# EAGLE design WiFiSensor (EAGLE 7.3.0)
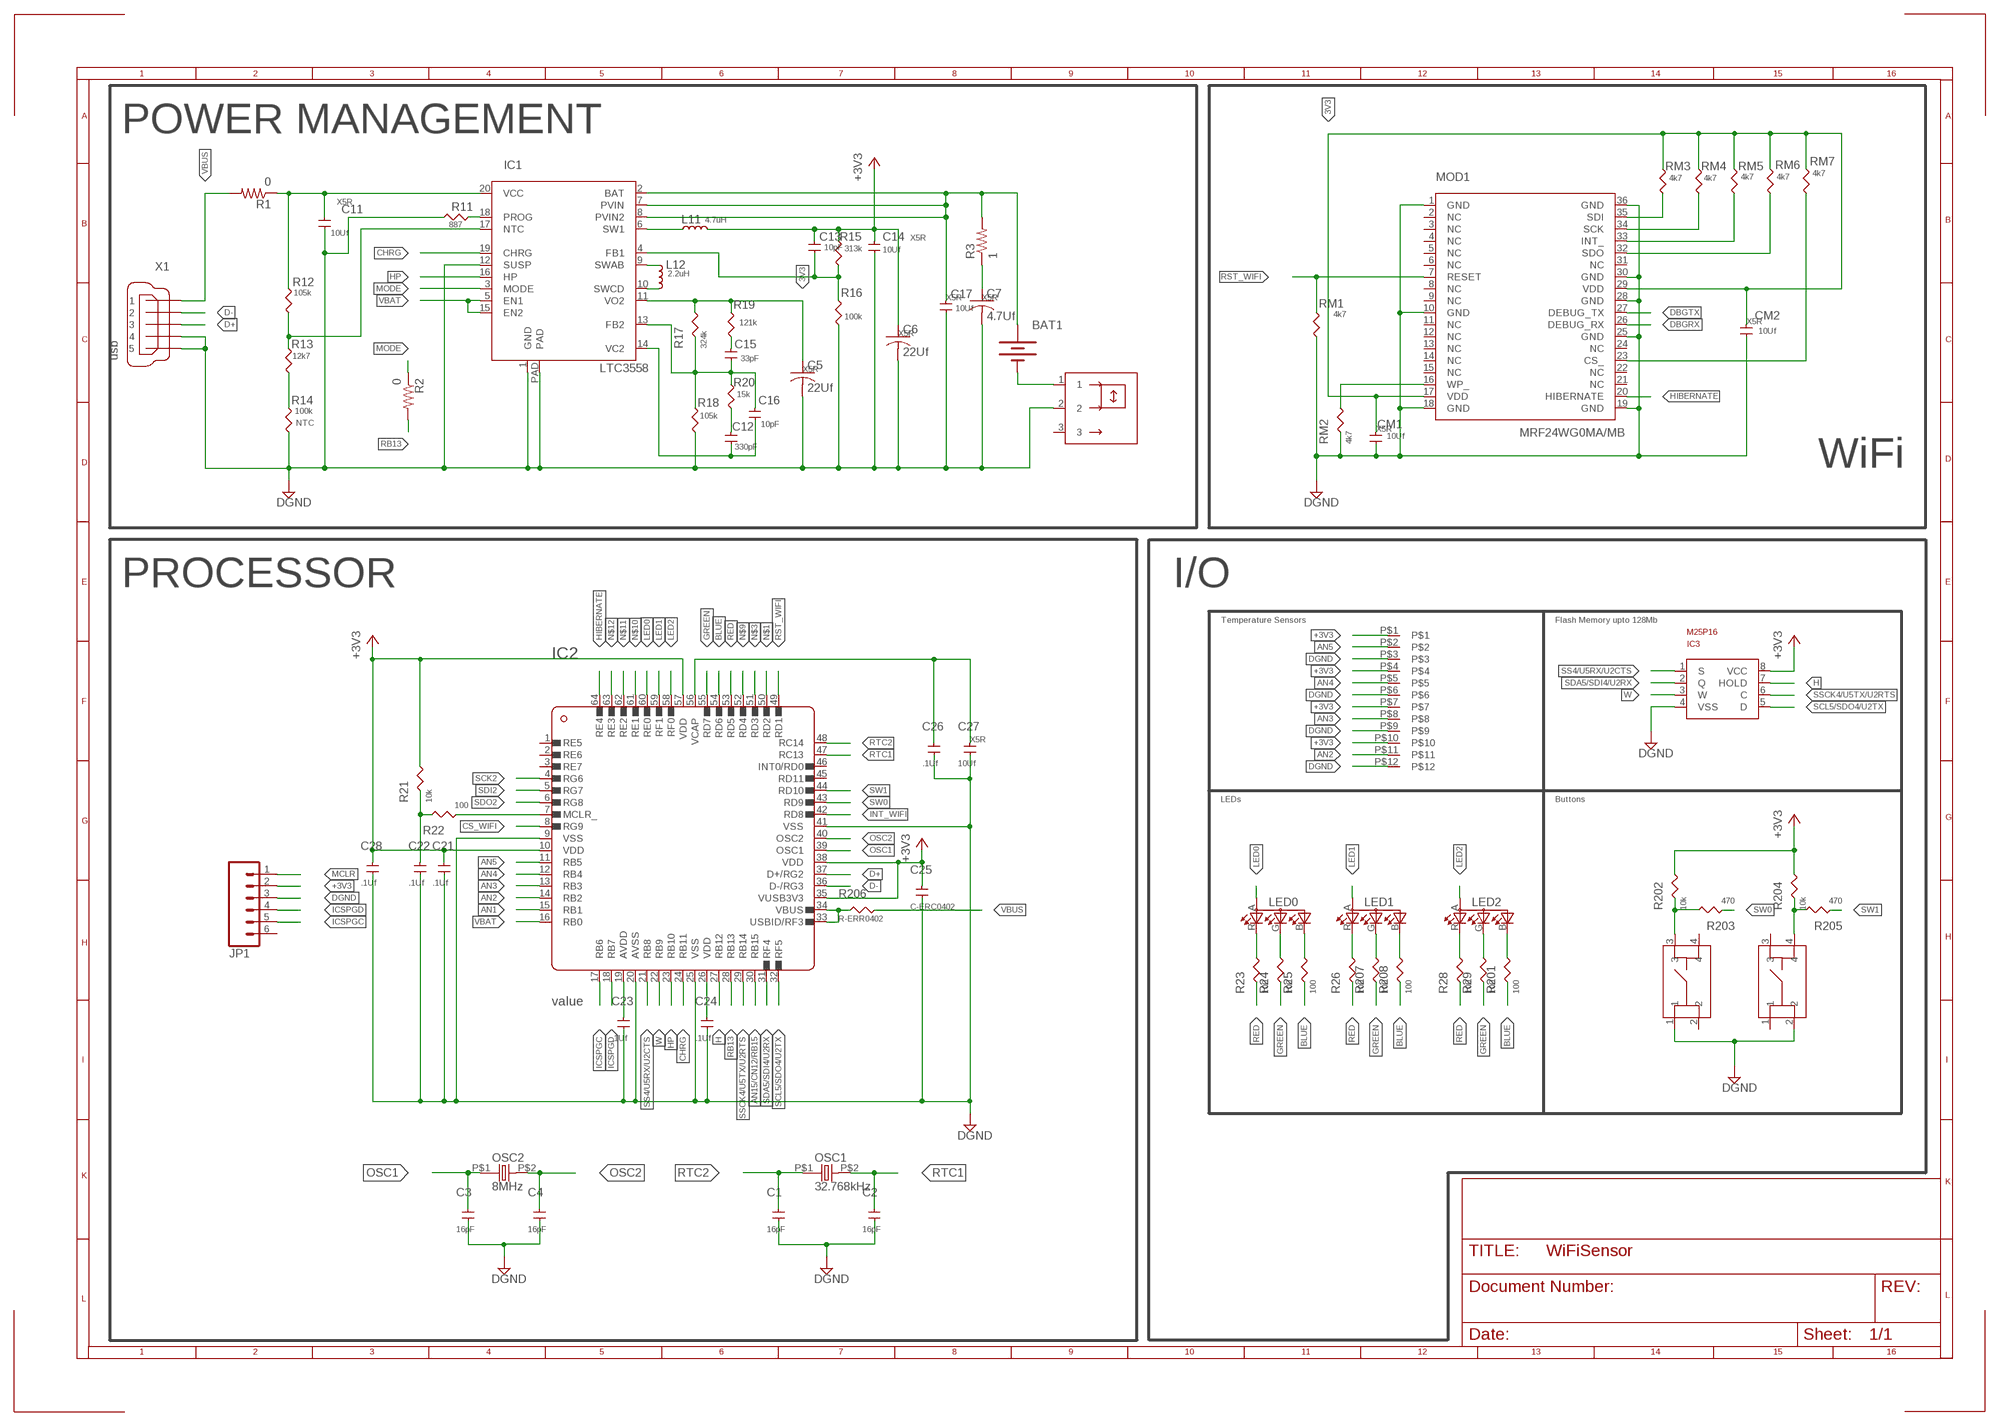
[diagram p0: schematic, sheet 1]

## Parts
BAT1  BATTERY245PTH  [BATTCON_245MM_PTH]
C1  16pF  C-ERC0402  [C0402]
C2  16pF  C-ERC0402  [C0402]
C3  16pF  C-ERC0402  [C0402]
C4  16pF  C-ERC0402  [C0402]
C5  22Uf  C-USC0805  [C0805]
C6  22Uf  C-USC0805  [C0805]
C7  4.7Uf  C-USC0402  [C0402]
C11  10Uf  C-ER  [C0805]
C12  330pF  C-ERC0402  [C0402]
C13  10pF  C-ERC0402  [C0402]
C14  10Uf  C-ER  [C0805]
C15  33pF  C-ERC0402  [C0402]
C16  10pF  C-ERC0402  [C0402]
C17  10Uf  C-ER  [C0805]
C21  .1Uf  C-ERC0402  [C0402]
C22  .1Uf  C-ERC0402  [C0402]
C23  .1Uf  C-ERC0402  [C0402]
C24  .1Uf  C-ERC0402  [C0402]
C25  C-ERC0402  [C0402]
C26  .1Uf  C-ERC0402  [C0402]
C27  10Uf  C-ER  [C0805]
C28  .1Uf  C-ERC0402  [C0402]
CM1  10Uf  C-ER  [C0805]
CM2  10Uf  C-ER  [C0805]
IC1  LTC3558  [QFN20]
IC2  PICMX32695F512H  [TQFP64]
IC3  M25P16  [VDFPN8]
JP1  M06LOCK  [1X06_LOCK]
L11  4.7uH  L-ER  [L3010]
L12  2.2uH  L-ER  [L3010]
LED0  1X1RGB  [1X1]
LED1  1X1RGB  [1X1]
LED2  1X1RGB  [1X1]
MOD1  MRF24WG0MA/MB  [MRF24]
OSC1  32.768kHz  ECX32  [ECX39]
OSC2  8MHz  CX532  [CX532]
R1  0  R-US_R1206  [R1206]
R2  0  R-US_R1206  [R1206]
R3  1  R-US_R0402  [R0402]
R11  887  R-ERR0402  [R0402]
R12  105k  R-ERR0402  [R0402]
R13  12k7  R-ERR0402  [R0402]
R14  100k  R-ERR0402  [R0402]
R15  313k  R-ERR0402  [R0402]
R16  100k  R-ERR0402  [R0402]
R17  324k  R-ERR0402  [R0402]
R18  105k  R-ERR0402  [R0402]
R19  121k  R-ERR0402  [R0402]
R20  15k  R-ERR0402  [R0402]
R21  10k  R-ERR0402  [R0402]
R22  100  R-ERR0402  [R0402]
R23  100  R-ERR0402  [R0402]
R24  100  R-ERR0402  [R0402]
R25  100  R-ERR0402  [R0402]
R26  100  R-ERR0402  [R0402]
R28  100  R-ERR0402  [R0402]
R29  100  R-ERR0402  [R0402]
R201  100  R-ERR0402  [R0402]
R202  10k  R-ERR0402  [R0402]
R203  470  R-ERR0402  [R0402]
R204  10k  R-ERR0402  [R0402]
R205  470  R-ERR0402  [R0402]
R206  R-ERR0402  [R0402]
R207  100  R-ERR0402  [R0402]
R208  100  R-ERR0402  [R0402]
RM1  4k7  R-ERR0402  [R0402]
RM2  4k7  R-ERR0402  [R0402]
RM3  4k7  R-ERR0402  [R0402]
RM4  4k7  R-ERR0402  [R0402]
RM5  4k7  R-ERR0402  [R0402]
RM6  4k7  R-ERR0402  [R0402]
RM7  4k7  R-ERR0402  [R0402]
SENSORS  12_127  [12-127]
U$1  C&K_JS  [SAQN]
U$2  ADTS  [4X5]
U$3  ADTS  [4X5]
X1  usb  MINI-USB-UX60A-MB-5ST  [UX60A-MB-5ST]

## Nets
3V3: C5.1 CM1.2 CM2.2 IC1.11(VO2) MOD1.17(VDD) MOD1.29(VDD) R17.2 R19.2 RM3.2 RM4.2 RM5.2 RM6.2 RM7.2
+3V3: C6.1 C13.2 C14.2 C21.2 C23.2 C24.2 C25.2 C28.2 IC2.10(VDD) IC2.19(AVDD) IC2.26(VDD) IC2.35(VUSB3V3) IC2.38(VDD) IC2.57(VDD) IC3.8(VCC) JP1.2 L11.P$2 R15.2 R21.2 R202.2 R204.2 SENSORS.P$1 SENSORS.P$4 SENSORS.P$7 SENSORS.P$10
AN1: IC2.15(RB1)
AN2: IC2.14(RB2) SENSORS.P$11
AN3: IC2.13(RB3) SENSORS.P$8
AN4: IC2.12(RB4) SENSORS.P$5
AN5: IC2.11(RB5) SENSORS.P$2
AN15/CN12/RB15: IC2.30(RB15)
BLUE: IC2.54(RD6) R25.1 R201.1 R208.1
CHRG: IC1.19(CHRG) IC2.24(RB11)
CS_WIFI: IC2.8(RG9) MOD1.23(CS_) RM7.1
D+: IC2.37(D+/RG2) X1.3
D-: IC2.36(D-/RG3) X1.2
DBGRX: MOD1.26(DEBUG_RX)
DBGTX: MOD1.27(DEBUG_TX)
DGND: C1.1 C2.1 C3.1 C4.1 C5.2 C6.2 C7.2 C11.1 C14.1 C17.1 C21.1 C22.1 C23.1 C24.1 C25.1 C26.1 C27.1 C28.1 CM1.1 CM2.1 IC1.1(GND) IC1.12(SUSP) IC1.PAD IC2.9(VSS) IC2.20(AVSS) IC2.25(VSS) IC2.41(VSS) IC3.4(VSS) JP1.3 MOD1.1(GND) MOD1.10(GND) MOD1.18(GND) MOD1.19(GND) MOD1.25(GND) MOD1.28(GND) MOD1.30(GND) MOD1.36(GND) R11.2 R14.1 R16.1 R18.1 RM1.1 RM2.1 SENSORS.P$3 SENSORS.P$6 SENSORS.P$9 SENSORS.P$12 U$1.2 U$2.2 U$3.1 X1.4 X1.5
GREEN: IC2.55(RD7) R24.1 R29.1 R207.1
H: IC2.27(RB12) IC3.7(HOLD)
HIBERNATE: IC2.64(RE4) MOD1.20(HIBERNATE)
HP: IC1.16(HP) IC2.23(RB10)
ICSPGC: IC2.17(RB6) JP1.5
ICSPGD: IC2.18(RB7) JP1.4
INT_WIFI: IC2.42(RD8) MOD1.33(INT_) RM5.1
LED0: IC2.60(RE0) LED0.A(A2)
LED1: IC2.59(RF1) LED1.A(A2)
LED2: IC2.58(RF0) LED2.A(A2)
MCLR: C22.2 JP1.1 R21.1 R22.2
MODE: IC1.3(MODE) R2.1
N$1: IC2.50(RD2)
N$2: IC1.18(PROG) R11.1
N$3: IC2.51(RD3)
N$4: IC1.17(NTC) R12.1 R13.2
N$5: R13.1 R14.2
N$6: C15.1 C16.2 IC1.13(FB2) R17.1 R18.2 R20.2
N$7: BAT1.2(-) U$1.1
N$8: C7.1 R3.1
N$9: IC2.52(RD4)
N$10: IC2.61(RE1)
N$11: IC2.62(RE2)
N$12: IC2.63(RE3)
N$13: IC1.9(SWAB) L12.P$1
N$14: IC1.10(SWCD) L12.P$2
N$15: IC1.6(SW1) L11.P$1
N$18: C15.2 R19.1
N$20: C12.2 R20.1
N$21: C12.1 C16.1 IC1.14(VC2)
N$24: IC2.33(USBID/RF3) IC2.34(VBUS) R206.1
N$25: IC2.7(MCLR_) R22.1
N$26: R202.1 R203.2 U$3.3
N$31: C26.2 C27.2 IC2.56(VCAP)
N$33: R204.1 R205.2 U$2.4
N$34: LED0.R(CRED) R23.2
N$40: LED0.G(CBLUE) R24.2
N$41: MOD1.16(WP_) RM2.2
N$42: LED0.B(CGREEN) R25.2
N$43: LED1.R(CRED) R26.2
N$44: LED1.G(CBLUE) R207.2
N$45: LED1.B(CGREEN) R208.2
N$46: LED2.R(CRED) R28.2
N$47: LED2.G(CBLUE) R29.2
N$48: LED2.B(CGREEN) R201.2
N$49: C13.1 IC1.4(FB1) R15.1 R16.2
N$100: C11.2 IC1.20(VCC) R1.1 R12.2
OSC1: C3.2 IC2.39(OSC1) OSC2.P$1
OSC2: C4.2 IC2.40(OSC2) OSC2.P$2
RB13: IC2.28(RB13) R2.2
RED: IC2.53(RD5) R23.1 R26.1 R28.1
RST_WIFI: IC2.49(RD1) MOD1.7(RESET) RM1.2
RTC1: C2.2 IC2.47(RC13) OSC1.P$2
RTC2: C1.2 IC2.48(RC14) OSC1.P$1
SCK2: IC2.4(RG6) MOD1.34(SCK) RM4.1
SCL5/SDO4/U2TX: IC2.32(RF5) IC3.5(D)
SDA5/SDI4/U2RX: IC2.31(RF4) IC3.2(Q)
SDI2: IC2.5(RG7) MOD1.32(SDO) RM6.1
SDO2: IC2.6(RG8) MOD1.35(SDI) RM3.1
SS4/U5RX/U2CTS: IC2.21(RB8) IC3.1(S)
SSCK4/U5TX/U2RTS: IC2.29(RB14) IC3.6(C)
SW0: IC2.43(RD9) R203.1
SW1: IC2.44(RD10) R205.1
VBAT: BAT1.3(+) C17.2 IC1.2(BAT) IC1.5(EN1) IC1.7(PVIN) IC1.8(PVIN2) IC1.15(EN2) IC2.16(RB0) R3.2
VBUS: R1.2 R206.2 X1.1
W: IC2.22(RB9) IC3.3(W)
Unconnected: IC2.1(RE5) IC2.2(RE6) IC2.3(RE7) IC2.45(RD11) IC2.46(INT0/RD0) JP1.6 MOD1.2(NC) MOD1.3(NC) MOD1.4(NC) MOD1.5(NC) MOD1.6(NC) MOD1.8(NC) MOD1.9(NC) MOD1.11(NC) MOD1.12(NC) MOD1.13(NC) MOD1.14(NC) MOD1.15(NC) MOD1.21(NC) MOD1.22(NC) MOD1.24(NC) MOD1.31(NC) U$1.3 U$2.1 U$2.3 U$3.2 U$3.4

## Notes on the sheet
- POWER MANAGEMENT
- WiFi
- PROCESSOR | I/O
- Temperature Sensors | Flash Memory upto 128Mb
- LEDs | Buttons

## Library data of the parts
BAT1 = SparkFun:BATTERY: Battery Holders Various common sizes : AA, AAA, 20mm coin cell and 12mm coin cell.
C1-C4 C12 C13 C15 C16 C21-C26 C28 = rcl:C-ER
C5-C7 = rcl:C-US: CAPACITOR, American symbol; TEMPCHAR: X5R
C11 C14 C17 C27 CM1 CM2 = rcl:C-ER; TEMPCHAR: X5R
IC1 = linear-technology:LTC3558
IC2 = microchip:PICMX32695F512H
IC3 = st-microelectronics:M25P16
JP1 = SparkFun:M06: Header 6 Standard 6-pin 0.1" header. Use with straight break away headers (SKU : PRT-00116), right angle break away headers (PRT-00553), swiss pins (PRT-00743), machine pins (PRT-00117), and female headers (PRT-00115). Molex polarized connector foot print use with SKU : PRT-08094 with associated crimp pins and housings. NOTES ON THE VARIANTS LOCK and LOCK_LONGPADS... This footprint was designed to help hold the alignment of a through-hole component (i.e. 6-pin header) while soldering it into place. You may notice that each hole has been shifted either up or down by 0.005 of an inch from it's more standard position (which is a perfectly straight line). This slight alteration caused the pins (the squares in the middle) to touch the edges of the holes. Because they are alternating, it causes a "brace" to hold the component in place. 0.005 has proven to be the perfect amount of "off-center" position when using our standard breakaway headers. Although looks a little odd when you look at the bare footprint, once you have a header in there, the alteration is very hard to notice. Also, if you push a header all the way into place, it is covered up entirely on the bottom side. This idea of altering the position of holes to aid alignment will be further integrated into the Sparkfun Library for other footprints. It can help hold any component with 3 or more connection pins.
L11 L12 = rcl:L-ER
LED0 LED1 LED2 = led:1X1RGB
MOD1 = microchip:MRF24WG0MA/MB
OSC1 = crystal:ECX32; DIGIPART: XC1658CT-ND
OSC2 = crystal:CX532; DIGIPART: XC1658CT-ND
R1-R3 = rcl:R-US_: RESISTOR, American symbol
R11-R13 R15-R26 R28 R29 R201-R208 RM1-RM7 = rcl:R-ER
R14 = rcl:R-ER; NTC: NTC
SENSORS = con-molex:12_127
U$1 = switch:C&K_JS
U$2 U$3 = switch:ADTS
X1 = con-hirose:MINI-USB-: MINI USB Connector Source: http://www.hirose.co.jp/cataloge_hp/e24000019.pdf

## Board
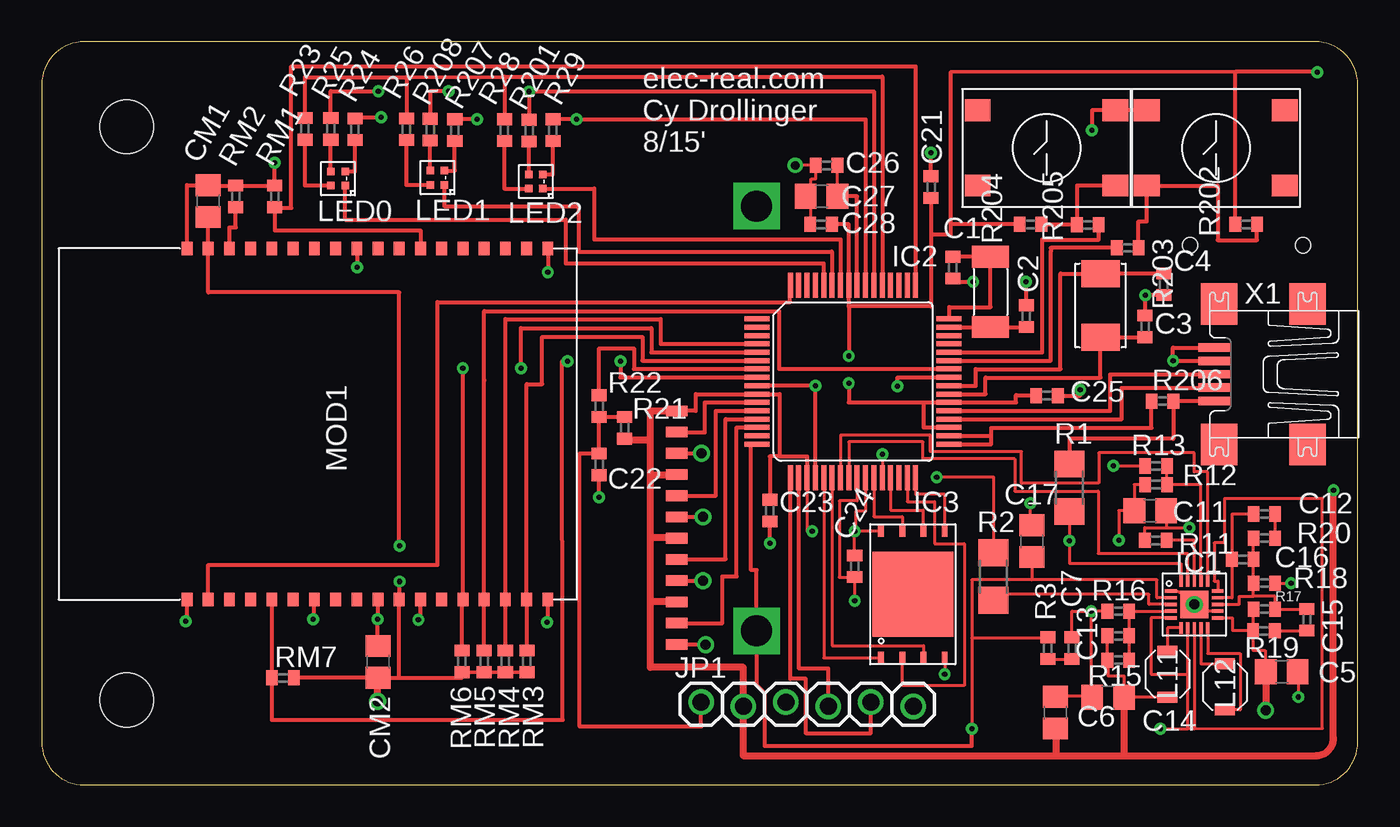
[diagram p1: board, top side]
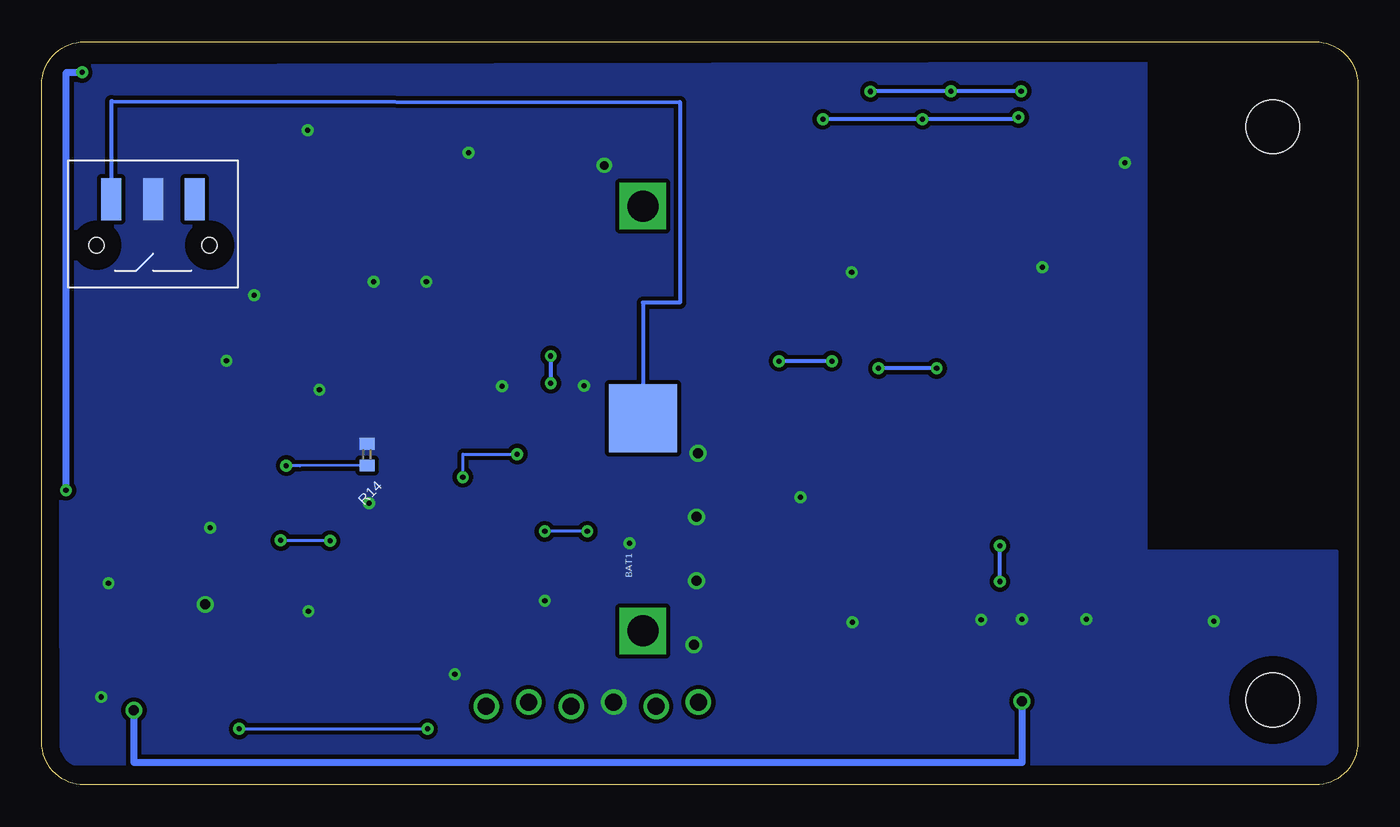
[diagram p2: board, bottom side, seen from below]

Size 78.74 x 44.45 mm. Coordinates in mm from the lower left corner, seen from the top.
Outline: 2.54,0 76.2,0 arc90 78.74,2.54 78.74,41.91 arc90 76.2,44.45 2.54,44.45 arc90 0,41.91 0,2.54 arc90 2.54,0
Copper layers (1*16): Top 0.035mm / dielectric 1.5mm / Bottom 0.035mm
Design rules "default *": minimum track width 7mil, minimum drill 12mil, track to track 8mil, track to pad 7mil, pad to pad 7mil, via to via 8mil, smd to smd 7mil, copper to edge 40mil, drill to drill 20mil, minimum pad ring 10mil, minimum via ring 8mil, stop-mask expansion 4mil, vias tented up to drill 0mil, thermal gap 10mil
Holes 3.2 mm at 5.08,5.08 5.08,39.37

### Footprints (pad centres in the part's own frame; a part is rotated, then mirrored left to right if it is on the bottom)
BATTCON_245MM_PTH = drill 1.854 square: 1 12.7,0; 3 -12.7,0 | smd 4.064 x 4.064: 2 0,0
C0402 = smd 0.7 x 0.9: 1 -0.65,0; 2 0.65,0
C0805 = smd 1.3 x 1.5: 1 -0.95,0; 2 0.95,0
QFN20 = smd 0.7 x 0.2: 1 -1.4,0.8; 2 -1.4,0.4; 3 -1.4,0; 4 -1.4,-0.4; 5 -1.4,-0.8; 11 1.4,-0.8; 12 1.4,-0.4; 13 1.4,0; 14 1.4,0.4; 15 1.4,0.8 | smd 0.2 x 0.7: 6 -0.8,-1.4; 7 -0.4,-1.4; 8 0,-1.4; 9 0.4,-1.4; 10 0.8,-1.4; 16 0.8,1.4; 17 0.4,1.4; 18 0,1.4; 19 -0.4,1.4; 20 -0.8,1.4 | smd 1.65 x 1.65: PAD 0,0
TQFP64 = smd 1.5 x 0.3: 1 -5.75,3.75; 2 -5.75,3.25; 3 -5.75,2.75; 4 -5.75,2.25; 5 -5.75,1.75; 6 -5.75,1.25; 7 -5.75,0.75; 8 -5.75,0.25; 9 -5.75,-0.25; 10 -5.75,-0.75; 11 -5.75,-1.25; 12 -5.75,-1.75; 13 -5.75,-2.25; 14 -5.75,-2.75; 15 -5.75,-3.25; 16 -5.75,-3.75; 33 5.75,-3.75; 34 5.75,-3.25; 35 5.75,-2.75; 36 5.75,-2.25; 37 5.75,-1.75; 38 5.75,-1.25; 39 5.75,-0.75; 40 5.75,-0.25; 41 5.75,0.25; 42 5.75,0.75; 43 5.75,1.25; 44 5.75,1.75; 45 5.75,2.25; 46 5.75,2.75; 47 5.75,3.25; 48 5.75,3.75 | smd 0.3 x 1.5: 17 -3.75,-5.75; 18 -3.25,-5.75; 19 -2.75,-5.75; 20 -2.25,-5.75; 21 -1.75,-5.75; 22 -1.25,-5.75; 23 -0.75,-5.75; 24 -0.25,-5.75; 25 0.25,-5.75; 26 0.75,-5.75; 27 1.25,-5.75; 28 1.75,-5.75; 29 2.25,-5.75; 30 2.75,-5.75; 31 3.25,-5.75; 32 3.75,-5.75; 49 3.75,5.75; 50 3.25,5.75; 51 2.75,5.75; 52 2.25,5.75; 53 1.75,5.75; 54 1.25,5.75; 55 0.75,5.75; 56 0.25,5.75; 57 -0.25,5.75; 58 -0.75,5.75; 59 -1.25,5.75; 60 -1.75,5.75; 61 -2.25,5.75; 62 -2.75,5.75; 63 -3.25,5.75; 64 -3.75,5.75
VDFPN8 = smd 0.762 x 0.356: 1 -3.81,1.905; 2 -3.81,0.635; 3 -3.81,-0.635; 4 -3.81,-1.905; 5 3.81,-1.905; 6 3.81,-0.635; 7 3.81,0.635; 8 3.81,1.905 | smd 5.08 x 4.826: NC 0,0
1X06_LOCK = drill 1.016: 1 0,0; 2 2.54,-0.254; 3 5.08,0; 4 7.62,-0.254; 5 10.16,0; 6 12.7,-0.254
L3010 = smd 0.65 x 1.2: P$1 -1.375,0; P$2 1.375,0
1X1 = smd 0.45 x 0.45: A 0.425,0.425; B -0.425,-0.425; G -0.425,0.425; R 0.425,-0.425
MRF24 = smd 0.8 x 0.65: 1 -10.5,13.77; 2 -10.5,12.5; 3 -10.5,11.23; 4 -10.5,9.96; 5 -10.5,8.69; 6 -10.5,7.42; 7 -10.5,6.15; 8 -10.5,4.88; 9 -10.5,3.61; 10 -10.5,2.34; 11 -10.5,1.07; 12 -10.5,-0.2; 13 -10.5,-1.47; 14 -10.5,-2.74; 15 -10.5,-4.01; 16 -10.5,-5.28; 17 -10.5,-6.55; 18 -10.5,-7.82; 19 10.5,-7.82; 20 10.5,-6.55; 21 10.5,-5.28; 22 10.5,-4.01; 23 10.5,-2.74; 24 10.5,-1.47; 25 10.5,-0.2; 26 10.5,1.07; 27 10.5,2.34; 28 10.5,3.61; 29 10.5,4.88; 30 10.5,6.15; 31 10.5,7.42; 32 10.5,8.69; 33 10.5,9.96; 34 10.5,11.23; 35 10.5,12.5; 36 10.5,13.77
ECX39 = smd 1.3 x 2.2: P$1 -2.1,0; P$2 2.1,0
CX532 = smd 1.6 x 2.3: P$1 -1.9,0; P$2 1.9,0
R1206 = smd 1.6 x 1.803: 1 -1.422,0; 2 1.422,0
R0402 = smd 0.7 x 0.9: 1 -0.65,0; 2 0.65,0
12-127 = smd 0.635 x 1.27: P$1 -6.985,0; P$2 -5.715,0; P$3 -4.445,0; P$4 -3.175,0; P$5 -1.905,0; P$6 -0.635,0; P$7 0.635,0; P$8 1.905,0; P$9 3.175,0; P$10 4.445,0; P$11 5.715,0; P$12 6.985,0
SAQN = smd 1.194 x 2.515: 1 -2.489,2.743; 2 0,2.743; 3 2.489,2.743 | hole 0.9: -3.378,0; 3.378,0
4X5 = smd 1.55 x 1.3: 1 -4.125,2.25; 2 4.125,2.25; 3 -4.125,-2.25; 4 4.125,-2.25
UX60A-MB-5ST = smd 2 x 0.5: 1 2.25,1.6; 2 2.25,0.8; 3 2.25,0; 4 2.25,-0.8; 5 2.25,-1.6 | smd 2.2 x 2.5: M1 -3.3,-4.2; M2 -3.3,4.2; M3 2,4.2; M4 2,-4.2

### Placement (x,y rotation side)
BAT1  42.77,21.92 90 bottom
C1  54.51,30.94 90 top
C2  58.9,28.04 270 top
C3  66.01,27.43 270 top
C4  67.13,29.95 90 top
C5  74.19,6.78 0 top
C6  60.66,4.32 90 top
C7  61.65,8.18 90 top
C11  66.32,16.41 180 top
C12  73.15,16.21 0 top
C13  64.41,8.92 180 top
C14  63.8,5.23 0 top
C15  75.69,9.88 270 top
C16  71.86,13.49 0 top
C17  59.23,14.58 270 top
C21  53.21,35.76 270 top
C22  33.35,19.18 90 top
C23  43.56,16.41 90 top
C24  48.64,13.08 90 top
C25  60.15,23.29 180 top
C26  46.96,37.06 0 top
C27  46.66,35.2 0 top
C28  46.63,33.53 0 top
CM1  9.96,34.92 270 top
CM2  20.12,7.37 270 top
IC1  68.96,10.79 0 top
IC2  48.54,24.13 0 top
IC3  52.12,11.4 90 top
JP1  39.45,4.95 0 top
L11  67.36,6.63 270 top
L12  70.79,5.87 270 top
LED0  17.73,36.27 270 top
LED1  23.67,36.32 270 top
LED2  29.57,36.09 270 top
MOD1  16.51,21.59 270 top
OSC1  56.77,29.49 270 top
OSC2  63.35,28.68 90 top
R1  61.49,17.78 90 top
R2  56.95,12.47 90 top
R3  60.2,8.18 90 top
R11  66.65,14.63 180 top
R12  66.67,17.96 180 top
R13  66.67,19.08 0 top
R14  59.28,19.76 270 bottom
R15  64.41,7.47 180 top
R16  64.41,10.39 0 top
R17  73.15,10.52 180 top
R18  73.15,12.06 180 top
R19  73.13,9.22 180 top
R20  73.15,14.76 180 top
R21  34.87,21.36 270 top
R22  33.35,22.66 270 top
R23  15.75,39.24 270 top
R24  18.75,39.22 270 top
R25  17.3,39.24 270 top
R26  21.82,39.22 270 top
R28  27.69,39.17 270 top
R29  30.58,39.17 270 top
R201  29.16,39.14 270 top
R202  72.06,33.53 180 top
R203  64.97,32.13 0 top
R204  59.16,33.53 180 top
R205  62.59,33.5 180 top
R206  67.06,22.96 0 top
R207  24.71,39.17 270 top
R208  23.24,39.19 270 top
RM1  13.94,35.2 270 top
RM2  11.61,35.2 270 top
RM3  29.03,7.39 270 top
RM4  27.74,7.39 270 top
RM5  26.47,7.39 270 top
RM6  25.15,7.39 270 top
RM7  14.43,6.4 0 top
SENSORS  38,15.39 270 top
U$1  72.09,32.28 0 bottom
U$2  60.12,38.1 0 top
U$3  70.26,38.1 0 top
X1  72.44,24.56 180 top

### Tracks (layer width: path | path; a pad name or v marks a point on that pad's centre or on a via)
3V3  (via drill 0.3, 0.6)
  Top 0.178: IC1.11 71.25,9.99 71.25,9.25 72.48,9.25 R19.2 | R17.2 72.48,10.52 R19.2 | R19.2 72.48,8.05 73.2,8.05 73.2,6.78 C5.1 73.76,6.76
  Top 0.203: RM6.2 RM5.2 RM4.2 RM3.2
  Top 0.254: CM1.2 MOD1.17 9.96,29.46 21.39,29.46 21.39,14.3 v21.41,14.3 | CM2.2 20.12,6.4 | 21.39,6.42 MOD1.29 21.41,11.09 v21.41,12.17 | CM2.2 21.39,6.42 | RM7.2 15.08,6.42 CM2.2 | RM6.2 25.15,6.42 21.39,6.42
  Top 0.406: C5.1 73.24,4.47 v73.23,4.47 | v20.09,5 20.09,6.42 CM2.2
  Bottom 0.254: v21.41,12.17 v21.41,14.3
  Bottom 0.406: v73.23,4.47 73.23,1.35 20.07,1.35 20.07,5 v20.09,5
+3V3  (via drill 0.3)
  Top 0.178: C13.2 R15.2 63.8,7.47 63.8,6.5 64.75,6.5 C14.2 67.36,5.23 L11.P$2 | IC2.26 49.29,16.36 48.69,16.36 48.69,15.16 v48.64,15.16 | v48.64,15.16 48.64,15.21 IC3.8 | C24.2 v48.64,15.16 | IC2.19 45.79,15.16 v46.1,15.16
  Top 0.203: R202.2 71.48,33.53
  Top 0.254: C28.2 48.29,33.53 IC2.57 48.28,28.63 | IC2.38 54.29,22.86 | IC2.38 58.29,22.88 58.29,23.32 59.5,23.32 C25.2 | C21.2 53.21,32.92 | 53.21,32.92 53.21,28.63 48.28,28.63 | 52.76,22.89 52.76,21.38 IC2.35 | 52.76,22.89 IC2.38 | R21.2 34.87,20.73 | C23.2 43.56,19.66 44.15,19.66 | 44.15,19.66 45.8,19.66 IC2.19 | 44.15,19.66 44.15,23.38 IC2.10 39.12,23.38 39.12,22.38 SENSORS.P$1 | 52.76,22.89 48.28,22.89 v48.28,24.03 | 48.28,28.63 v48.28,25.65 | 71.42,42.65 76.33,42.65 v76.33,42.62 | 71.42,42.65 54.38,42.62 54.38,33.53 | 54.38,33.53 54.38,32.92 53.21,32.92 | C6.1 60.68,3.37 | 71.48,33.53 71.42,33.53 71.42,42.65 | R204.2 54.38,33.53
  Top 0.406: 36.42,10.95 36.42,7.04 41.99,7.04 JP1.2 41.96,4.7 41.96,1.75 60.68,1.75 | 36.42,10.95 36.42,14.78 | 36.42,14.78 36.42,18.57 | 36.42,18.57 SENSORS.P$4 | SENSORS.P$7 38,14.78 36.42,14.78 | SENSORS.P$10 36.42,10.95 | 36.42,18.57 36.42,20.65 | 36.42,20.65 36.42,22.38 SENSORS.P$1 | R21.2 34.87,20.65 36.42,20.65 | 64.84,5.23 C14.2 64.75,1.75 | 60.68,1.75 64.75,1.75 | 64.75,1.75 76.25,1.75 arc90 77.29,2.79 v77.29,17.63 | 60.68,3.37 60.68,1.75
  Bottom 0.178: v46.1,15.16 v48.64,15.16
  Bottom 0.254: v48.28,25.65 v48.28,24.03
  Bottom 0.406: v77.29,17.63 77.27,42.62 v76.33,42.62
AN2
  Top 0.254: IC2.14 41.58,21.38 41.58,12.47 40.72,12.47 40.72,9.68 SENSORS.P$11
AN3
  Top 0.254: IC2.13 40.92,21.88 40.92,13.51 38,13.51 SENSORS.P$8
AN4
  Top 0.254: IC2.12 40.34,22.38 40.34,17.3 SENSORS.P$5
AN5
  Top 0.254: IC2.11 39.67,22.88 39.67,21.08 38,21.08 SENSORS.P$2
BLUE  (via drill 0.3)
  Top 0.254: R201.1 v29.16,41.48 49.79,41.48 IC2.54 | R25.1 17.3,41.5 v20.14,41.5 | R208.1 23.24,41.5 v24.33,41.5
  Bottom 0.254: v29.16,41.48 24.33,41.48 v24.33,41.5 v20.14,41.5
CHRG
  Top 0.178: IC1.19 68.56,13.84 63.22,13.84 63.22,17.58 58.22,17.58 58.22,19.51 52.73,19.51 52.73,20.52 48.29,20.52 IC2.24
CS_WIFI  (via drill 0.3)
  Top 0.254: MOD1.23 RM7.1 | RM7.1 13.79,6.71 | IC2.8 34.62,24.38 v34.62,25.35 | v31.47,25.35 31.14,25.35 31.17,3.89 13.78,3.89 RM7.1
  Bottom 0.254: v31.47,25.35 v34.62,25.35
D+
  Top 0.254: X1.3 63.93,24.56 63.93,22.38 IC2.37
D-
  Top 0.254: IC2.36 64.62,21.88 64.62,23.75 70.19,23.75 X1.2
DGND  (via drill 0.3, 0.5, 0.6)
  Top 0.178: IC1.12 68.96,10.39 IC1.PAD 68.96,11.12 68.56,11.53 68.05,11.53 68,11.58 67.56,11.58 IC1.1 | C28.1 45.98,34.93 C27.1 | 45.98,35.2 46.02,35.24 46.02,36.25 46.31,36.25 C26.1 v45.09,37.06 | IC2.25 48.79,16.99 47.73,16.99 47.73,12.43 | IC3.4 v54.03,6.63 | v48.64,11.02 C24.1 47.73,12.43 | 47.73,12.41 47.73,12.43 | R18.1 v74.75,12.06 | C5.2 75.19,5.79 v75.18,5.26 | R16.1 v62.79,10.39 | v62.79,10.39 61.65,10.39 C7.2 | C14.1 arc-90 62.79,5.3 | 62.79,5.3 v62.79,10.39 | R11.2 66,15.39 67.27,15.39 | 67.27,15.39 v68.66,15.39 | C11.1 67.27,15.39 | C17.1 59.16,15.53 v59.16,16.84 | 62.79,5.3 60.66,5.3 C6.2
  Top 0.203: 20.12,8.02 CM2.1 20.09,8.02
  Top 0.254: MOD1.19 8.69,9.78 v8.61,9.78 8.66,9.78 | MOD1.25 16.31,9.91 v16.23,9.91 | MOD1.28 20.12,9.91 v20.09,9.91 20.09,8.02 | MOD1.36 30.28,9.73 v30.23,9.73 | MOD1.30 22.66,9.88 v22.53,9.88 | C27.1 45.98,35.2 | v13.95,37.21 RM1.1 RM2.1 9.96,35.85 CM1.1 8.69,35.88 MOD1.18 | MOD1.1 v30.28,30.66 | C25.1 62.13,23.29 v62.13,23.65 | X1.5 67.69,26.16 v67.69,25.38 | v67.69,25.38 70.19,25.38 X1.4 | MOD1.10 18.87,32.09 v18.87,30.96 | IC2.9 45.31,23.88 v46.3,23.88 46.3,18.38 IC2.20 | IC2.41 51.21,24.38 v51.21,23.85 | C21.1 v53.21,37.82 | v67.69,25.38 67.69,25.64 | C3.1 66.04,28.08 v66.04,29.29 67.13,29.29 C4.1 | C1.1 54.51,30.1 v55.73,30.1 | C2.1 58.9,30.1 v58.88,30.1 | v33.35,17.2 C22.1 | SENSORS.P$3 v39.47,19.84 | SENSORS.P$6 v39.57,16.03 | SENSORS.P$12 39.73,8.41 v39.73,8.38 | SENSORS.P$9 v39.57,12.22 | v43.56,14.45 C23.1 | U$2.2 U$3.1 62.84,40.35 v62.84,39.17
  other vias: 68.96,10.79
  pour Bottom (isolate 0.254, no thermals): 1.27,1.27 77.55,1.24 77.62,43.03 12.7,43.18 12.7,13.97 1.27,13.97
GREEN  (via drill 0.3)
  Top 0.254: R29.1 v32,39.82 49.29,39.82 IC2.55 | R24.1 18.75,39.93 v20.3,39.93 | v26.04,39.82 R207.1
  Bottom 0.254: v20.3,39.93 20.3,39.82 v26.04,39.82 v32,39.82
H
  Top 0.178: IC2.27 49.79,16.05 51.49,16.05 IC3.7
HIBERNATE
  Top 0.254: MOD1.20 9.96,13.16 23.67,13.16 23.67,28.88 44.78,28.88 IC2.64
HP
  Top 0.178: IC1.16 69.76,18.72 68.96,18.72 68.96,19.86 63.25,19.86 63.25,18.06 58.62,18.03 58.62,19.94 53.16,19.94 53.16,20.93 47.79,20.93 IC2.23 47.78,18.38
ICSPGC
  Top 0.254: IC2.17 44.79,6.35 45.72,6.35 45.72,3.1 49.61,3.1 JP1.5
ICSPGD
  Top 0.254: JP1.4 47.07,6.96 45.31,6.96 45.31,18.38 IC2.18
INT_WIFI
  Top 0.254: RM5.1 MOD1.33 26.47,24.18 26.47,24.21 26.47,28.35 44.12,28.35 44.12,24.88 IC2.42
LED0
  Top 0.254: LED0.A 18.15,33.81 31.34,33.81 31.34,31.19 46.79,31.19 IC2.60
LED1
  Top 0.254: LED1.A 24.1,34.62 32.13,34.62 32.13,31.9 47.27,31.9 47.27,29.88 IC2.59
LED2
  Top 0.254: LED2.A 33.05,35.67 33.05,32.64 47.79,32.64 IC2.58
MCLR
  Top 0.254: JP1.1 39.45,3.5 32.18,3.5 32.18,19.83 C22.2 R22.2 R21.1
MODE
  Top 0.178: IC1.3 66.24,10.79 66.24,11.4 56.95,11.4 R2.1
N$2
  Top 0.178: IC1.18 68.96,14.63 R11.1
N$4
  Top 0.178: IC1.17 69.36,17.96 R12.1 R13.2
N$5  (via drill 0.3)
  Top 0.178: v64.11,19.1 66.03,19.1 R13.1
  Bottom 0.178: R14.2 63.3,19.09 v64.11,19.1
N$6
  Top 0.178: C15.1 75.69,10.52 R17.1 73.8,11.28 72.5,11.28 | IC1.13 71.65,10.79 71.65,11.28 72.5,11.28 | 72.5,11.28 R18.2 C16.2 R20.2
N$7
  Bottom 0.254: BAT1.2 42.77,28.85 40.56,28.85 40.56,40.84 74.55,40.89 74.57,40.89 U$1.1
N$8
  Top 0.178: R3.1 C7.1
N$13
  Top 0.178: IC1.9 69.36,7.24 L12.P$1
N$14
  Top 0.178: IC1.10 69.76,7.87 71.7,7.87 71.7,4.49 L12.P$2
N$15
  Top 0.178: IC1.6 67.36,9.39 L11.P$1
N$18
  Top 0.178: R19.1 C15.2
N$20
  Top 0.178: R20.1 C12.2
N$21
  Top 0.178: C12.1 71.21,16.2 C16.1 71.21,11.2 IC1.14
N$24
  Top 0.254: IC2.34 arc-90 IC2.34 56.82,20.88 | 56.82,20.88 56.82,21.01 56.82,21.36 66.41,21.36 R206.1 | IC2.33 56.82,20.38 56.82,20.88
N$25
  Top 0.254: R22.1 33.35,26.11 35.43,26.11 35.43,24.88 IC2.7
N$26
  Top 0.254: R202.1 72.71,32.59 70.36,32.59 70.36,35.85 U$3.3 66.12,35.85 66.12,33.71 65.62,33.71 R203.2
N$31
  Top 0.178: C27.2 C26.2
  Top 0.254: C27.2 48.79,35.2 IC2.56
N$33
  Top 0.254: R204.1 59.81,33.5 R205.2 61.94,35.85 U$2.4
N$34
  Top 0.254: LED0.R 15.75,35.85 R23.2
N$40
  Top 0.254: LED0.G 18.75,36.7 R24.2
N$41
  Top 0.254: MOD1.16 11.23,33.35 11.61,33.35 RM2.2
N$42
  Top 0.254: LED0.B R25.2
N$43
  Top 0.254: LED1.R 21.82,35.9 R26.2
N$44
  Top 0.254: LED1.G 24.71,36.75 R207.2
N$45
  Top 0.254: R208.2 LED1.B
N$46
  Top 0.254: LED2.R 27.69,35.67 R28.2
N$47
  Top 0.254: LED2.G 30.58,36.52 R29.2
N$48
  Top 0.254: LED2.B 29.16,36.52 R201.2
N$49
  Top 0.178: R15.1 C13.1 R16.2 IC1.4
N$100  (via drill 0.3)
  Top 0.178: R1.1 v61.49,14.61 61.49,13.26 68.15,13.26 68.15,12.2 IC1.20 | v64.44,14.63 64.44,16.41 C11.2 65.37,17.96 R12.2
  Bottom 0.178: v64.44,14.63 61.49,14.63 v61.49,14.61
OSC1
  Top 0.254: IC2.39 56.46,23.38 56.46,24.36 63.35,24.36 OSC2.P$1 C3.2
OSC2
  Top 0.254: IC2.40 55.88,23.88 55.88,24.87 60.96,24.87 60.96,30.58 OSC2.P$2 67.13,30.58 C4.2
RB13  (via drill 0.3)
  Top 0.178: v53.54,18.41 56.95,18.41 R2.2 | v50.29,19.79 IC2.28
  Bottom 0.178: v53.54,18.41 53.54,19.79 v50.29,19.79
RED
  Top 0.254: 27.69,42.37 R28.1 | IC2.53 50.29,42.37 27.69,42.37 | R23.1 15.75,42.34 21.82,42.34 | 21.82,42.34 27.69,42.37 | 21.82,42.34 R26.1
RST_WIFI
  Top 0.254: MOD1.7 22.66,33.17 13.95,33.17 RM1.2 13.95,34.52 14.94,34.52 14.94,42.98 52.29,42.98 IC2.49
RTC1
  Top 0.254: IC2.47 OSC1.P$2 C2.2
RTC2
  Top 0.254: C1.2 OSC1.P$1 56.77,28.57 54.3,28.57 54.3,27.88 IC2.48
SCK2
  Top 0.254: RM4.1 MOD1.34 27.74,27.86 37.03,27.86 37.03,26.38 IC2.4
SCL5/SDO4/U2TX
  Top 0.178: IC3.5 54.03,17.37 52.3,17.37 IC2.32
SDA5/SDI4/U2RX
  Top 0.178: IC2.31 51.79,16.94 53.42,16.94 53.42,14.43 55.19,14.43 55.19,5.94 51.49,5.94 IC3.2
SDI2  (via drill 0.3)
  Top 0.254: RM6.1 25.15,11.09 MOD1.32 v25.2,24.92 | v28.68,24.92 28.68,27.33 36.47,27.33 36.47,25.88 IC2.5
  Bottom 0.254: v25.2,24.92 v28.68,24.92
SDO2
  Top 0.254: RM3.1 29.03,11.09 MOD1.35 29.01,23.98 29.95,23.98 29.95,26.8 35.94,26.8 35.94,25.38 IC2.6
SS4/U5RX/U2CTS
  Top 0.178: IC2.21 46.79,7.59 IC3.1
SSCK4/U5TX/U2RTS
  Top 0.178: IC2.29 50.79,16.43 52.73,16.43 52.73,15.21 IC3.6
SW0
  Top 0.254: IC2.43 60.38,25.38 60.38,31.8 60.38,31.9 60.38,32.13 R203.1
SW1
  Top 0.254: IC2.44 59.87,25.88 59.87,32.61 63.25,32.61 R205.1
VBAT  (via drill 0.3)
  Top 0.178: IC1.15 70.38,11.6 70.38,12.19 70.16,12.19 70.16,14.48 70.76,14.48 70.76,17.12 76.63,17.12 76.63,3.38 68.94,3.35 | 68.94,3.35 68.56,3.35 | IC1.7 68.56,6.63 | 68.56,6.63 68.56,3.35 | IC1.8 68.96,3.38 68.94,3.35 | IC1.5 66.37,9.99 66.37,6.63 68.56,6.63 | 60.4,8.79 R3.2 60.2,8.79 55.65,8.79 | v66.93,3.35 68.56,3.35 | 55.65,8.79 v55.65,3.35 | 59.28,13.58 C17.2 59.23,12.27 | IC1.2 66.73,11.2 66.73,12.27 59.23,12.27 | 59.23,12.27 55.65,12.27 55.65,8.79
  Top 0.254: 42.77,20.38 IC2.16 42.44,20.38 42.44,12.85 42.77,12.85 BAT1.3 42.77,5.99 43.26,5.51 43.26,2.34 55.65,2.34 v55.65,3.35
  Bottom 0.178: v66.93,3.35 v55.65,3.35
VBUS
  Top 0.254: X1.1 | X1.1 R206.2 67.71,20.7 61.49,20.7 R1.2
W
  Top 0.178: IC2.22 47.29,8.33 52.76,8.33 IC3.3

### Text on the board
tPlace: elec-real.com / Cy Drollinger / 8/15'